# Altium schematic sheet HDMI.SchDoc
size A4; SheetNumber: 10; SheetTotal: 17
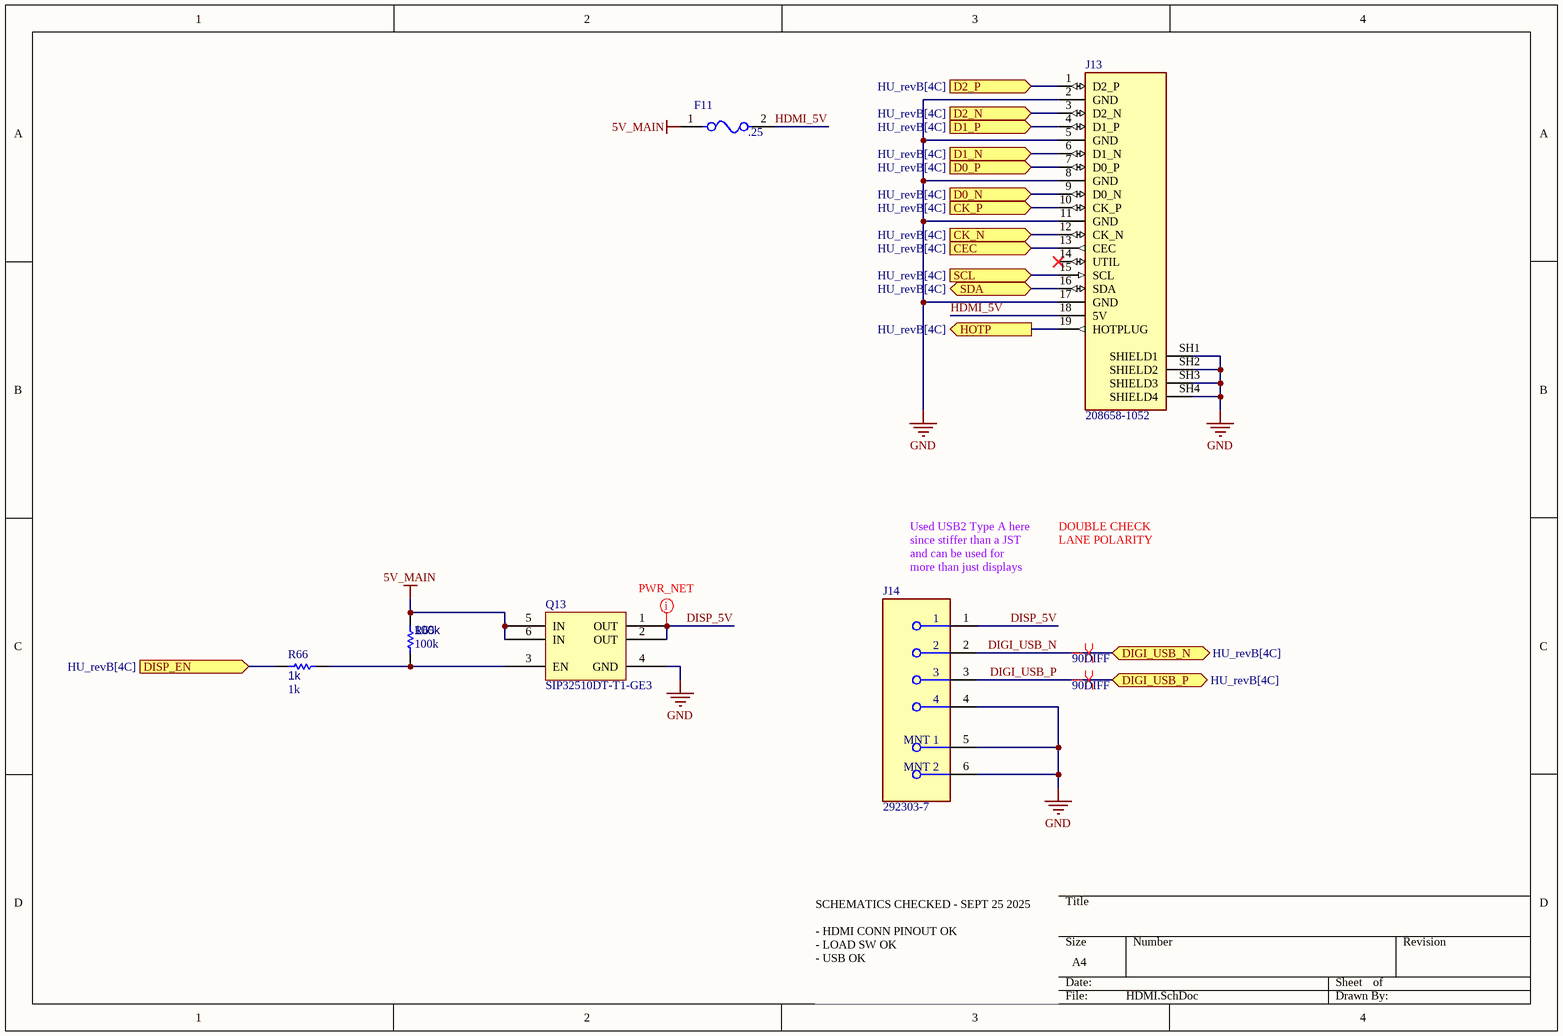
[diagram p0: HDMI.SchDoc]

## Parts
F11  .25  [FP-0685T-MFG]
J13  208658-1052  [208658-1052-Footprint-1]
J14  292303-7  [FP-292303-7-MFG]
Q13  SIP32510DT-T1-GE3  [SOT95P284X110-6N]
R65  100k  [R0603B]
R66  1k  [R0603B]

## Ports
CEC (in, see HU_revB[4C]), CK_N (in, see HU_revB[4C]), CK_P (in, see HU_revB[4C]), D0_N (in, see HU_revB[4C]), D0_P (in, see HU_revB[4C]), D1_N (in, see HU_revB[4C]), D1_P (in, see HU_revB[4C]), D2_N (in, see HU_revB[4C]), D2_P (in, see HU_revB[4C]), DIGI_USB_N (bidir, see HU_revB[4C]), DIGI_USB_P (bidir, see HU_revB[4C]), DISP_EN (in, see HU_revB[4C]), HOTP (out, see HU_revB[4C]), SCL (in, see HU_revB[4C]), SDA (bidir, see HU_revB[4C])

## Nets
5V_MAIN: F11.1 Q13.5(IN) Q13.6(IN) R65.2
GND: J13.2(GND) J13.5(GND) J13.8(GND) J13.11(GND) J13.17(GND) J13.SH1(SHIELD1) J13.SH2(SHIELD2) J13.SH3(SHIELD3) J13.SH4(SHIELD4) J14.4 J14.5(MNT_1) J14.6(MNT_2) Q13.4(GND)
CEC: J13.13(CEC) ; port CEC
CK_N: J13.12(CK_N) ; port CK_N
CK_P: J13.10(CK_P) ; port CK_P
D0_N: J13.9(D0_N) ; port D0_N
D0_P: J13.7(D0_P) ; port D0_P
D1_N: J13.6(D1_N) ; port D1_N
D1_P: J13.4(D1_P) ; port D1_P
D2_N: J13.3(D2_N) ; port D2_N
D2_P: J13.1(D2_P) ; port D2_P
DIGI_USB_N: J14.2 ; port DIGI_USB_N
DIGI_USB_P: J14.3 ; port DIGI_USB_P
DISP_5V: J14.1 Q13.1(OUT) Q13.2(OUT)
DISP_EN: R66.2 ; port DISP_EN
HDMI_5V: F11.2 J13.18(5V)
HOTP: J13.19(HOTPLUG) ; port HOTP
SCL: J13.15(SCL) ; port SCL
SDA: J13.16(SDA) ; port SDA
NetQ13_3: Q13.3(EN) R65.1 R66.1

Not connected (* = marked no-connect by the designer): J13 14(UTIL)*

## Layout directives
differential pair; differential pair class 90DIFF: DIGI_USB_N, DIGI_USB_P
net class PWR: DISP_5V

## Notes on the sheet
- Used USB2 Type A here since stiffer than a JST and can be used for more than just displays
- DOUBLE CHECK LANE POLARITY
- SCHEMATICS CHECKED - SEPT 25 2025
  - HDMI CONN PINOUT OK
  - LOAD SW OK
  - USB OK

## Library data of the parts
F11 = CMP-16042-000006-1: FUSE BOARD MNT 5A 63VAC/VDC 1206; RoHS Compliant: Yes
J13 = CMP-002-00089-3: HDMI CONNECTOR, RCPT, 19POS, SMT; Available until stocks are exhausted Alternative available; Gender: Female; Min Operating Temperature: -20°C; Max Operating Temperature: 85°C; Pins: 19
J14 = CMP-03360-000008-1: CONN RCPT USB2.0 TYPEA 4P SMD RA; Manufacturer: TE Connectivity; Is Female: yes; Current Rating: 1A; Number Of Contacts: 4; Voltage Rating: 30V; Conn Orientation: Right Angle; Shielding: true; Digikey Description: CONN RCPT USB2.0 TYPEA 4P SMD RA; Manufacturer Part Number: 292303-7; Automotive: No; Category: Conn; Temperature: -55°C to +85°C; ComponentLink2Description: Datasheet; Mouser Description: USB Connectors USB A R/A Recpt Assy SMT; Contact Material: Gold,Nickel; Package: 292303-7; Device Class L3: unset; Octopart: https://octopart.com/292303-7-te+connectivity-42840369; RoHS: TRUE; Device Class L2: USB Connectors; ComponentLink2URL: https://www.te.com/usa-en/product-292303-7.html?te_bu=Cor&te_type=other&te_campaign=oct_glo_cor-oct-global-oth-prtnr-fy19-oct-octo-buy-bom_sma-298_2&elqCampaignId=35216; Temperature Range Low: -55°C; Usb Standard: USB 2.0; Temperature Range High: +85°C; Lead Free: Yes; Device Class L1: Connectors
Q13 = CMP-019-00054-1: Power Switch ICs – Power Distribution; VISHAY; SIP32510DT-T1-GE3; 1; 1; 5.5 V; SOT-23-6; Max Supply Voltage: 5.5V; Max Power Dissipation: 833mW; Min Supply Voltage: 1.2V; Case/Package: SOT-23-6; Mounting Technology: Surface Mount; Max Operating Temperature: 85°C; Min Operating Temperature: -40°C
R65 R66 = CMP-009-00002-14: Resistor
  R65: Value: 100k
  R66: Value: 1k